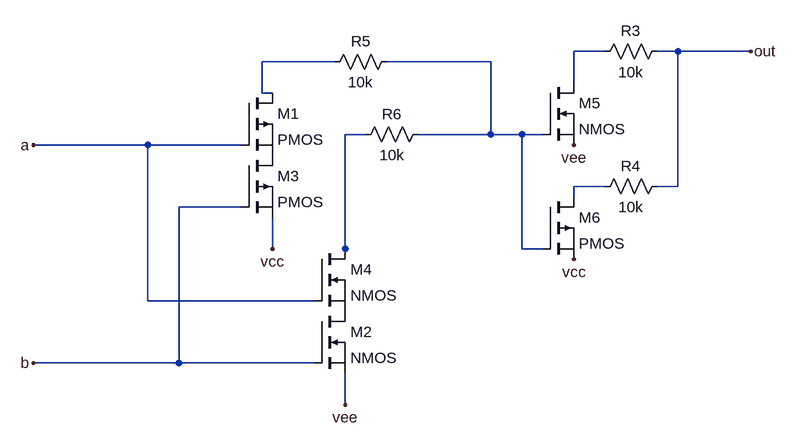
[diagram p0: schematic TAND.asc]
TAND.asc, the LTspice schematic file:
Version 4
SHEET 1 1456 680
WIRE 256 -464 208 -464
WIRE 368 -464 336 -464
WIRE 480 -464 368 -464
WIRE -160 -448 -272 -448
WIRE 80 -448 -80 -448
WIRE 208 -416 208 -464
WIRE -272 -400 -272 -448
WIRE -256 -400 -272 -400
WIRE -112 -336 -144 -336
WIRE 80 -336 80 -448
WIRE 80 -336 -32 -336
WIRE 128 -336 80 -336
WIRE 160 -336 128 -336
WIRE -448 -320 -624 -320
WIRE -304 -320 -448 -320
WIRE 256 -256 208 -256
WIRE 368 -256 368 -464
WIRE 368 -256 336 -256
WIRE 208 -240 208 -256
WIRE -304 -224 -400 -224
WIRE -256 -160 -256 -208
WIRE -144 -160 -144 -336
WIRE 128 -160 128 -336
WIRE 160 -160 128 -160
WIRE -144 -144 -144 -160
WIRE -448 -80 -448 -320
WIRE -192 -80 -448 -80
WIRE -400 16 -400 -224
WIRE -400 16 -624 16
WIRE -192 16 -400 16
WIRE -144 80 -144 32
FLAG -144 80 vee
FLAG -624 -320 a
FLAG -624 16 b
FLAG -256 -160 vcc
FLAG 208 -320 vee
FLAG 480 -464 out
FLAG 208 -144 vcc
SYMBOL pmos -304 -400 R0
SYMATTR InstName M1
SYMBOL nmos -192 -64 R0
SYMATTR InstName M2
SYMBOL pmos -304 -304 R0
SYMATTR InstName M3
SYMBOL nmos -192 -160 R0
SYMATTR InstName M4
SYMBOL nmos 160 -416 R0
SYMATTR InstName M5
SYMBOL Res 352 -480 R90
WINDOW 0 0 56 VBottom 2
WINDOW 3 32 56 VTop 2
SYMATTR InstName R3
SYMATTR Value 10k
SYMBOL pmos 160 -240 R0
SYMATTR InstName M6
SYMBOL Res 352 -272 R90
WINDOW 0 0 56 VBottom 2
WINDOW 3 32 56 VTop 2
SYMATTR InstName R4
SYMATTR Value 10k
SYMBOL Res -64 -464 R90
WINDOW 0 0 56 VBottom 2
WINDOW 3 32 56 VTop 2
SYMATTR InstName R5
SYMATTR Value 10k
SYMBOL Res -16 -352 R90
WINDOW 0 0 56 VBottom 2
WINDOW 3 32 56 VTop 2
SYMATTR InstName R6
SYMATTR Value 10k

The netlist it stands for:
* TAND.asc
M1 N002 a P001 P001 PMOS
M2 P002 b vee vee NMOS
M3 P001 b vcc vcc PMOS
M4 N004 a P002 P002 NMOS
M5 N001 N003 vee vee NMOS
R3 out N001 10k
M6 N005 N003 vcc vcc PMOS
R4 out N005 10k
R5 N003 N002 10k
R6 N003 N004 10k
.model NMOS NMOS
.model PMOS PMOS
.lib standard.mos
.backanno
.end